# EAGLE schematic power_board (EAGLE 6.4)
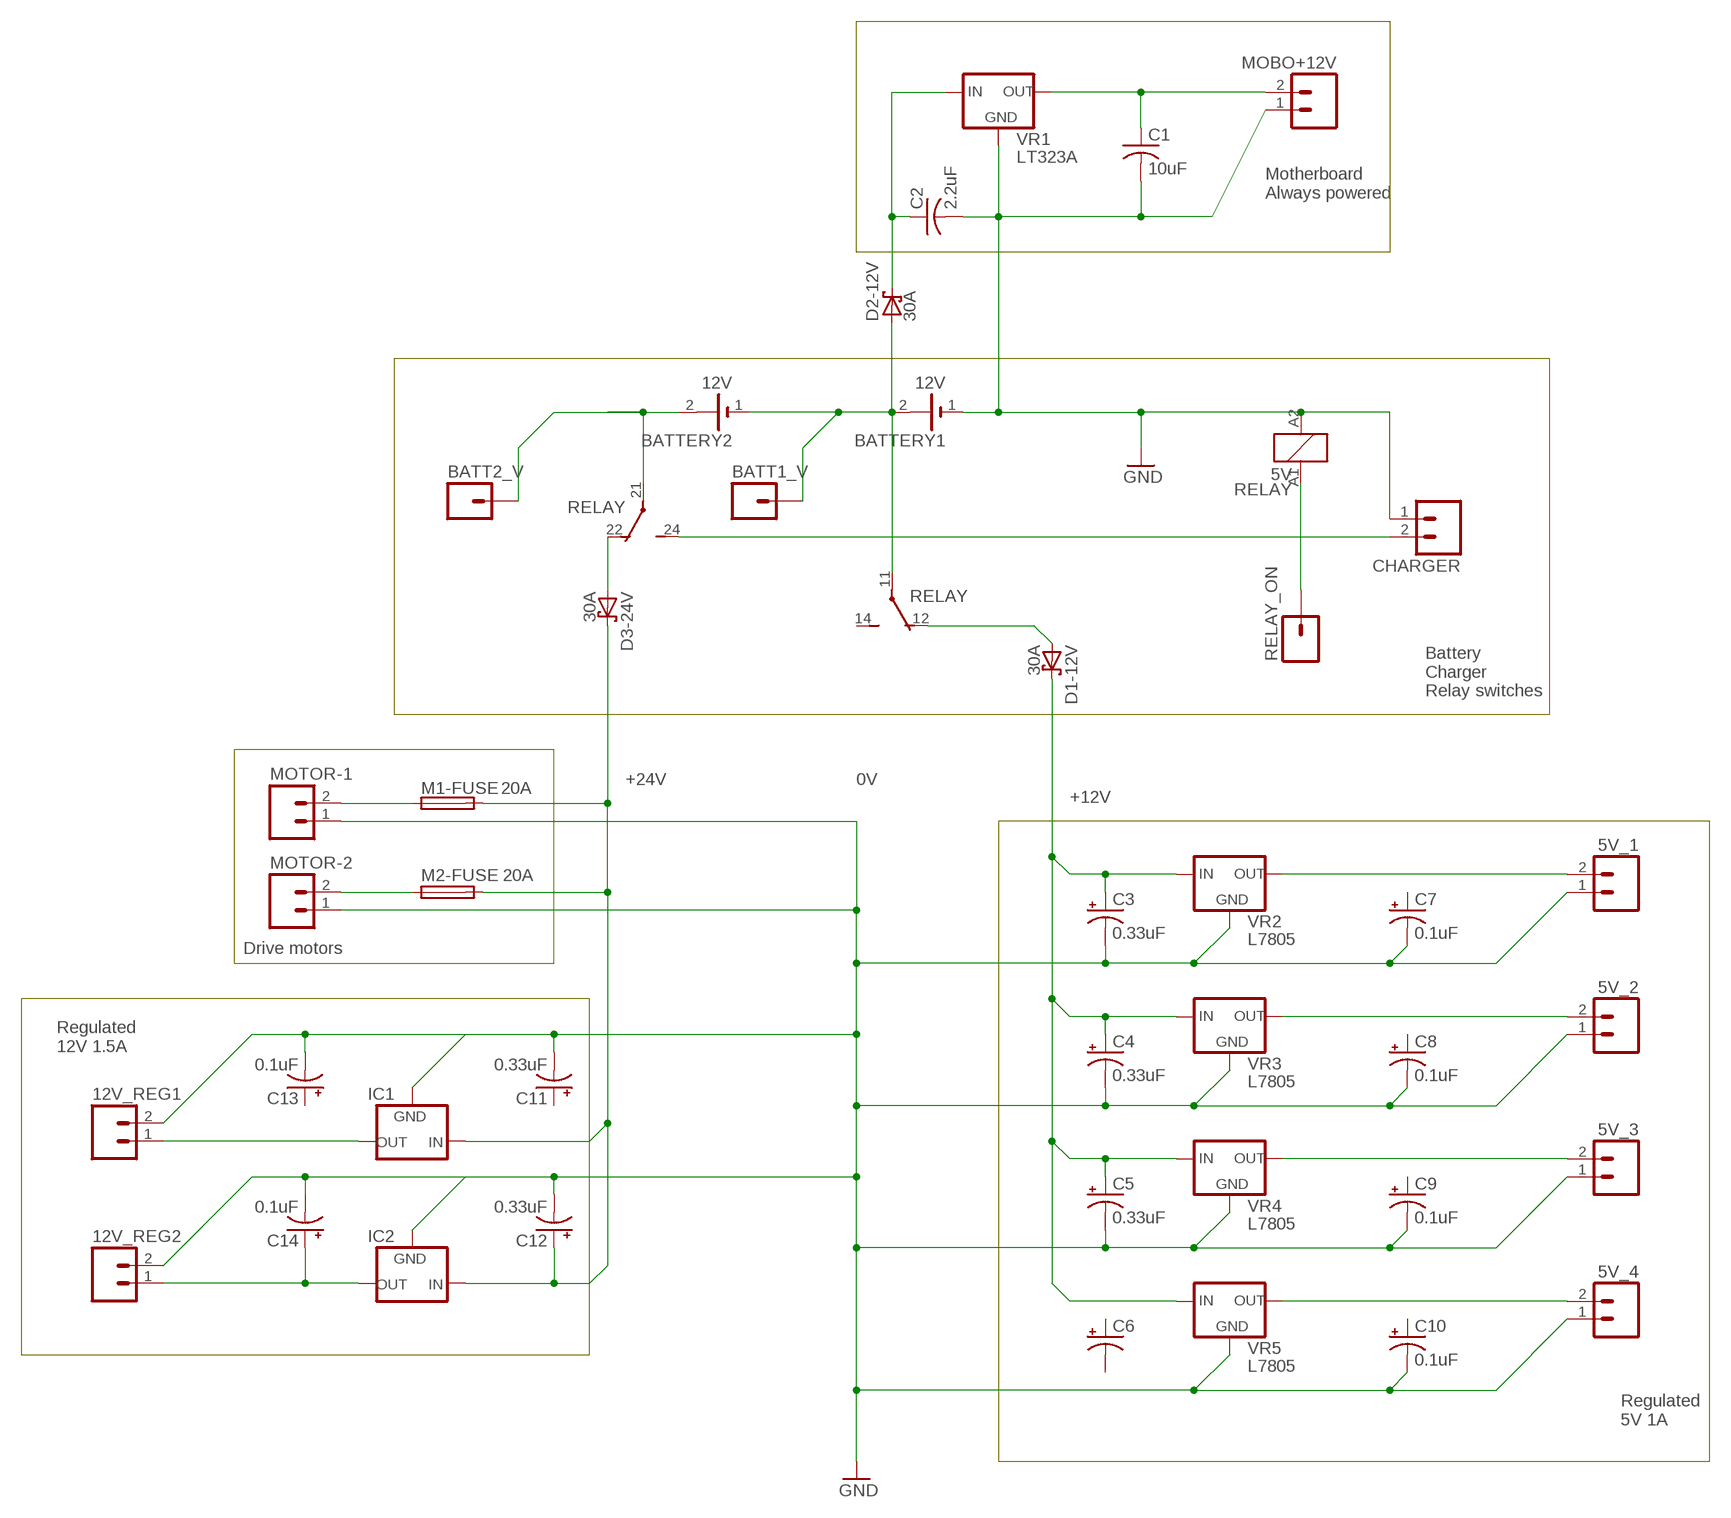
[diagram p0: schematic, sheet 1]

## Parts
5V_1  2-HOLESSC3.81MM  [SCREWTERMINAL-3.81MM]
5V_2  2-HOLESSC3.81MM  [SCREWTERMINAL-3.81MM]
5V_3  2-HOLESSC3.81MM  [SCREWTERMINAL-3.81MM]
5V_4  2-HOLESSC3.81MM  [SCREWTERMINAL-3.81MM]
12V_REG1  2-HOLESSC3.81MM  [SCREWTERMINAL-3.81MM]
12V_REG2  2-HOLESSC3.81MM  [SCREWTERMINAL-3.81MM]
BATT1_V  1-HOLE  [1-HOLE_BIG]
BATT2_V  1-HOLE  [1-HOLE_BIG]
BATTERY1  12V  BATTERY-ST  [SCREWTERMINAL-5MM]
BATTERY2  12V  BATTERY-ST  [SCREWTERMINAL-5MM]
C1  10uF  CAPACITOR  [C050-024X044]
C2  2.2uF  CAPACITOR  [C050-024X044]
C3  0.33uF  CAPACITOR_POL  [E2,5-5]
C4  0.33uF  CAPACITOR_POL  [E2,5-5]
C5  0.33uF  CAPACITOR_POL  [E2,5-5]
C6  CAPACITOR_POL  [E2,5-5]
C7  0.1uF  CAPACITOR_POL  [E2,5-5]
C8  0.1uF  CAPACITOR_POL  [E2,5-5]
C9  0.1uF  CAPACITOR_POL  [E2,5-5]
C10  0.1uF  CAPACITOR_POL  [E2,5-5]
C11  0.33uF  CAPACITOR_POL  [E2,5-5]
C12  0.33uF  CAPACITOR_POL  [E2,5-5]
C13  0.1uF  CAPACITOR_POL  [E2,5-5]
C14  0.1uF  CAPACITOR_POL  [E2,5-5]
CHARGER  24V  2-HOLESSC5MM  [SCREWTERMINAL-5MM]
D1-12V  30A  NTST30100SG-H  [TO22-DIODE-H]
D2-12V  30A  NTST30100SG-H  [TO22-DIODE-H]
D3-24V  30A  NTST30100SG-H  [TO22-DIODE-H]
IC1  L7812CD2T-TRTO-263  [TO263]
IC2  L7812CD2T-TRTO-263  [TO263]
M1-FUSE  20A  FUSE  [FUSE-5X20MM_SMD]
M2-FUSE  20A  FUSE  [FUSE-5X20MM_SMD]
MOBO+12V  2-HOLESSC3.81MM  [SCREWTERMINAL-3.81MM]
MOTOR-1  2-HOLESSC5MM  [SCREWTERMINAL-5MM]
MOTOR-2  2-HOLESSC5MM  [SCREWTERMINAL-5MM]
RELAY  5V  RT424A05  [RELAY_RT2]
RELAY_ON  1-HOLE"  [1-HOLE]
VR1  LT323A  LT323AT-V  [TO220V]
VR2  L7805  L7805ACD2T-TR  [TO263]
VR3  L7805  L7805ACD2T-TR  [TO263]
VR4  L7805  L7805ACD2T-TR  [TO263]
VR5  L7805  L7805ACD2T-TR  [TO263]

## Nets
GND: 5V_1.1 5V_2.1 5V_3.1 5V_4.1 12V_REG1.2 12V_REG2.2 BATTERY1.1(-) C1.2 C2.2 C3.- C4.- C5.- C7.- C8.- C9.- C10.- C11.- C12.- C13.- C14.- CHARGER.1 IC1.3(GND) IC2.3(GND) MOBO+12V.1 MOTOR-1.1 MOTOR-2.1 RELAY.A2 VR1.2(GND) VR2.3(GND) VR3.3(GND) VR4.3(GND) VR5.3(GND)
N$1: BATT1_V.P$1 BATTERY1.2(+) BATTERY2.1(-) D2-12V.P$1(A) RELAY.11(2:P)
N$2: CHARGER.2 RELAY.24(3:S)
N$3: C12.+ D3-24V.P$2(C) IC1.1(IN) IC2.1(IN) M1-FUSE.P$2 M2-FUSE.P$2
N$4: D3-24V.P$1(A) RELAY.22(3:O)
N$5: BATT2_V.P$1 BATTERY2.2(+) RELAY.21(3:P)
N$6: D1-12V.P$1(A) RELAY.12(2:O)
N$7: 5V_1.2 VR2.2(OUT)
N$8: C1.1 MOBO+12V.2 VR1.3(OUT)
N$9: M1-FUSE.P$1 MOTOR-1.2
N$10: M2-FUSE.P$1 MOTOR-2.2
N$11: RELAY.A1 RELAY_ON.1
N$12: C2.1 D2-12V.P$2(C) VR1.1(IN)
N$13: 5V_2.2 VR3.2(OUT)
N$14: 5V_3.2 VR4.2(OUT)
N$15: 5V_4.2 VR5.2(OUT)
N$16: C3.+ C4.+ C5.+ D1-12V.P$2(C) VR2.1(IN) VR3.1(IN) VR4.1(IN) VR5.1(IN)
N$17: 12V_REG1.1 IC1.2(OUT)
N$18: 12V_REG2.1 C14.+ IC2.2(OUT)
Unconnected: C6.+ C6.- C7.+ C8.+ C9.+ C10.+ C11.+ C13.+ RELAY.14(2:S)

## Notes on the sheet
- Motherboard
  Always powered
- Battery
  Charger
  Relay switches
- +24V | 0V
- +12V
- Drive motors
- Regulated
  12V 1.5A
- Regulated
  5V 1A

## Library data of the parts
5V_1-5V_4 12V_REG1 12V_REG2 CHARGER MOBO+12V MOTOR-1 MOTOR-2 = parts:2-HOLES: TERMINAL 2-PIN Holes for connecting 2 pin terminal
BATT1_V BATT2_V RELAY_ON = parts:1-HOLE: ONE HOLE Single hole on board
BATTERY1 BATTERY2 = parts:BATTERY: BATTERY battery with hole variants to mount to board
C1 C2 = parts:CAPACITOR: CAPACITOR, American symbol
C3-C14 = parts:CAPACITOR_POL: POLARIZED CAPACITOR, American symbol
D1-12V D2-12V D3-24V = parts:NTST30100SG: <DIODE NTST30100SG Schottky 100V 30A rectifier
IC1 IC2 = parts:L7812CD2T-TR: VOLTAGE REGULATOR 12V 1.5A voltage regulator
M1-FUSE M2-FUSE = parts:FUSE: FUSE
RELAY = parts:RT424A: Relay DPDT DPDT relay 8A contact 5V coil; MPN: RT424A05; OC_FARNELL: unknown; OC_NEWARK: 48M7975
VR1 = parts:LT323AT: VOLTAGE REGULATOR 5V 3A voltage regulator
VR2-VR5 = parts:L7805ACD2T-TR: VOLTAGE REGULATOR 5V 1A surface mount voltage regulator